# EAGLE design sqw_11c (EAGLE 5.11)
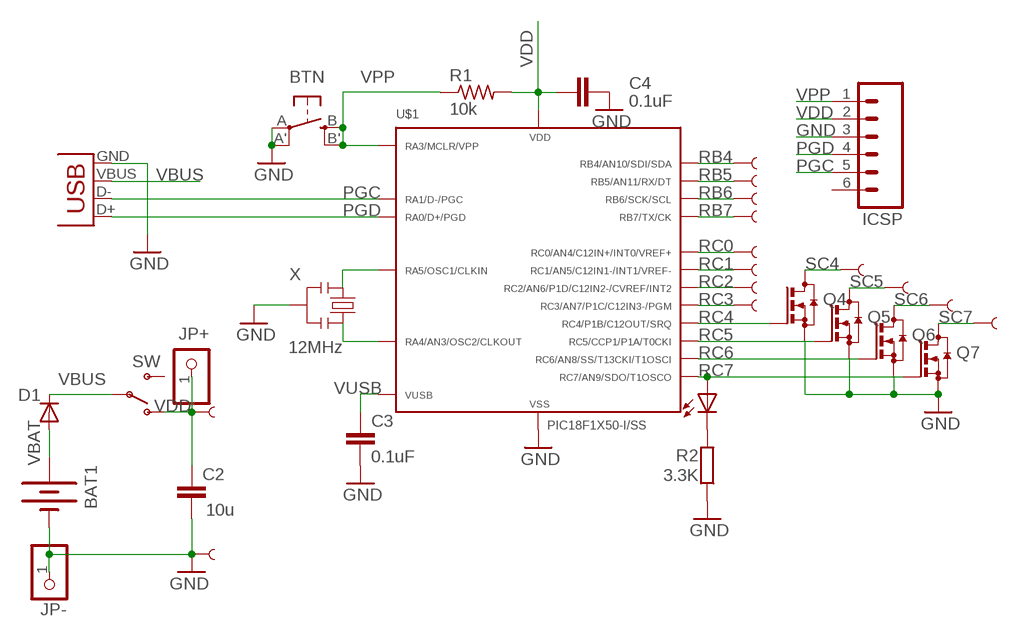
[diagram p0: schematic, sheet 1]

## Parts
BAT1  BATTERY20MM_4LEGS  [BATTCON_20MM_4LEGS]
BTN  EVQQ2  [EVQ-Q2]
C2  10u  C-EUC0805  [C0805]
C3  0.1uF  C-EUC0805  [C0805]
C4  0.1uF  C-EUC0805  [C0805]
D1  DIODESOT23  [SOT23-3]
ICSP  M06SIP  [1X06]
JP+  PINHD-1X1CB  [1X01-CLEANBIG]
JP-  PINHD-1X1CB  [1X01-CLEANBIG]
LED  0805  LEDCHIPLED_0805  [CHIPLED_0805]
PB4  SEWTAP61  [PETAL-SMALL-2SIDE1]
PB5  SEWTAP6  SEWTAP61  [PETAL-SMALL-2SIDE1]
PB6  SEWTAP6  SEWTAP61  [PETAL-SMALL-2SIDE1]
PB7  SEWTAP6  SEWTAP61  [PETAL-SMALL-2SIDE1]
PC0  SEWTAP6  SEWTAP61  [PETAL-SMALL-2SIDE1]
PC1  SEWTAP6  SEWTAP61  [PETAL-SMALL-2SIDE1]
PC2  SEWTAP6  SEWTAP61  [PETAL-SMALL-2SIDE1]
PC3  SEWTAP6  SEWTAP61  [PETAL-SMALL-2SIDE1]
PG  SEWTAP6  SEWTAP611  [PETAL-SMALL-2SIDE11]
PSC4  SEWTAP6  SEWTAP61  [PETAL-SMALL-2SIDE1]
PSC5  SEWTAP6  SEWTAP61  [PETAL-SMALL-2SIDE1]
PSC6  SEWTAP6  SEWTAP61  [PETAL-SMALL-2SIDE1]
PSC7  SEWTAP6  SEWTAP61  [PETAL-SMALL-2SIDE1]
PVCC  SEWTAP6  SEWTAP611  [PETAL-SMALL-2SIDE11]
Q4  BSS123  [SOT23]
Q5  BSS123  [SOT23]
Q6  BSS123  [SOT23]
Q7  BSS123  [SOT23]
R1  10k  R-US_R0805  [R0805@1]
R2  3.3K  R-EU_R0805  [R0805]
SW  SPDT  SWITCH-SPSTSMD2  [SWITCH-SPDT-SMD]
U$1  PIC18F1X50-I/SS  [SSOP20]
X  12MHz  RESONATORSMD  [RESONATOR-SMD]
X1  USBSMD  [USB-MINIB]

## Nets
GND: BAT1.2(-) BTN.A'(P1) BTN.A(P) C2.2 C3.2 C4.2 ICSP.3 JP-.1 PG.1 Q4.2(S) Q5.2(S) Q6.2(S) Q7.2(S) R2.1 U$1.20 X1.GND X.2
N$2: U$1.2 X.1
N$3: U$1.3 X.3
N$14: LED.C R2.2
PGC: ICSP.5 U$1.18 X1.D-
PGD: ICSP.4 U$1.19 X1.D+
RB4: PB4.1 U$1.13
RB5: PB5.1 U$1.12
RB6: PB6.1 U$1.11
RB7: PB7.1 U$1.10
RC0: PC0.1 U$1.16
RC1: PC1.1 U$1.15
RC2: PC2.1 U$1.14
RC3: PC3.1 U$1.7
RC4: Q4.1(G) U$1.6
RC5: Q5.1(G) U$1.5
RC6: Q6.1(G) U$1.8
RC7: LED.A Q7.1(G) U$1.9
SC4: PSC4.1 Q4.3(D)
SC5: PSC5.1 Q5.3(D)
SC6: PSC6.1 Q6.3(D)
SC7: PSC7.1 Q7.3(D)
VBAT: BAT1.1(+) D1.1(A)
VBUS: D1.3(C) SW.2(P) X1.VBUS
VDD: C2.1 C4.1 ICSP.2 JP+.1 PVCC.1 R1.2 SW.1(O) U$1.1
VPP: BTN.B'(S1) BTN.B(S) ICSP.1 R1.1 U$1.4
VUSB: C3.1 U$1.17
Unconnected: ICSP.6 SW.3(S)

## Library data of the parts
BAT1 = SparkFunNew:BATTERY: Battery Holders Various common sizes : AA, AAA, 20mm coin cell and 12mm coin cell.
BTN = adafruit:EVQQ2: SMT 6mm switch, EVQQ2 series http://www.ladyada.net/library/eagle
C2 = resistor:C-EU: CAPACITOR, European symbol
C3 C4 = rcl:C-EU: CAPACITOR, European symbol
D1 = SparkFun:DIODE: Diode These are standard reverse protection diodes and small signal diodes. SMA package can handle up to about 1A. SOD-323 can handle about 200mA. What the SOD-323 package when ordering, there are some mfgs out there that are 5-pin packages.
ICSP = SparkFunNew:M06: Header 6 Standard 6-pin 0.1" header. Use with straight break away headers (SKU : PRT-00116), right angle break away headers (PRT-00553), swiss pins (PRT-00743), machine pins (PRT-00117), and female headers (PRT-00115). Molex polarized connector foot print use with SKU : PRT-08094 with associated crimp pins and housings. NOTES ON THE VARIANTS LOCK and LOCK_LONGPADS... This footprint was designed to help hold the alignment of a through-hole component (i.e. 6-pin header) while soldering it into place. You may notice that each hole has been shifted either up or down by 0.005 of an inch from it's more standard position (which is a perfectly straight line). This slight alteration caused the pins (the squares in the middle) to touch the edges of the holes. Because they are alternating, it causes a "brace" to hold the component in place. 0.005 has proven to be the perfect amount of "off-center" position when using our standard breakaway headers. Although looks a little odd when you look at the bare footprint, once you have a header in there, the alteration is very hard to notice. Also, if you push a header all the way into place, it is covered up entirely on the bottom side. This idea of altering the position of holes to aid alignment will be further integrated into the Sparkfun Library for other footprints. It can help hold any component with 3 or more connection pins.
JP+ JP- = adafruit:PINHD-1X1: Pin header 1x1 for 0.1" spacing With round pins
LED = led:LED: LED OSRAM: - CHIPLED LG R971, LG N971, LY N971, LG Q971, LY Q971, LO R971, LY R971 LH N974, LH R974 LS Q976, LO Q976, LY Q976 LO Q996 - Hyper CHIPLED LW Q18S LB Q993, LB Q99A, LB R99A - SideLED LS A670, LO A670, LY A670, LG A670, LP A670 LB A673, LV A673, LT A673, LW A673 LH A674 LY A675 LS A676, LA A676, LO A676, LY A676, LW A676 LS A679, LY A679, LG A679 - Hyper Micro SIDELED® LS Y876, LA Y876, LO Y876, LY Y876 LT Y87S - SmartLED LW L88C, LW L88S LB L89C, LB L89S, LG L890 LS L89K, LO L89K, LY L89K LS L896, LA L896, LO L896, LY L896 - TOPLED LS T670, LO T670, LY T670, LG T670, LP T670 LSG T670, LSP T670, LSY T670, LOP T670, LYG T670 LG T671, LOG T671, LSG T671 LB T673, LV T673, LT T673, LW T673 LH T674 LS T676, LA T676, LO T676, LY T676, LB T676, LH T676, LSB T676, LW T676 LB T67C, LV T67C, LT T67C, LS T67K, LO T67K, LY T67K, LW E67C LS E67B, LA E67B, LO E67B, LY E67B, LB E67C, LV E67C, LT E67C LW T67C LS T679, LY T679, LG T679 LS T770, LO T770, LY T770, LG T770, LP T770 LB T773, LV T773, LT T773, LW T773 LH T774 LS E675, LA E675, LY E675, LS T675 LS T776, LA T776, LO T776, LY T776, LB T776 LHGB T686 LT T68C, LB T68C - Hyper Mini TOPLED® LB M676 - Mini TOPLED Santana® LG M470 LS M47K, LO M47K, LY M47K Source: http://www.osram.convergy.de LUXEON: - LUMILED® LXK2-PW12-R00, LXK2-PW12-S00, LXK2-PW14-U00, LXK2-PW14-V00 LXK2-PM12-R00, LXK2-PM12-S00, LXK2-PM14-U00 LXK2-PE12-Q00, LXK2-PE12-R00, LXK2-PE12-S00, LXK2-PE14-T00, LXK2-PE14-U00 LXK2-PB12-K00, LXK2-PB12-L00, LXK2-PB12-M00, LXK2-PB14-N00, LXK2-PB14-P00, LXK2-PB14-Q00 LXK2-PR12-L00, LXK2-PR12-M00, LXK2-PR14-Q00, LXK2-PR14-R00 LXK2-PD12-Q00, LXK2-PD12-R00, LXK2-PD12-S00 LXK2-PH12-R00, LXK2-PH12-S00 LXK2-PL12-P00, LXK2-PL12-Q00, LXK2-PL12-R00 Source: www.luxeon.com KINGBRIGHT: KA-3528ASYC Source: www.kingbright.com
PB4-PB7 PC0 PC1-PC3 PG PSC4-PSC7 PVCC = LilyPad-Wearables:SEWTAP
Q4-Q7 = transistor-small-signal:BSS123: N-CHANNEL MOS FET
R1 = rcl:R-US_: RESISTOR, American symbol
R2 = rcl:R-EU_: RESISTOR, European symbol
SW = SparkFun:SWITCH-SPST: SPST Switch Simple slide switch. Spark Fun Electronics SKU : COM-00102
U$1 = Forrequi:PIC18F1X50: PIC18F13K50/14K50 20-Pin USB Flash Microcontrollers with nanoWatt Technology The PIC18F14K50 brings advanced features and exceptional value to the embedded USB market. This low cost PIC® Microcontroller features a full speed USB 2.0 compliant interface that c an automatically change clock sources and power levels upon connection to a host, making it an exceptional device for battery-powered applications. The addition of mTouch(TM) touch sensing compatibility, a 10-bit ADC, motor control PWMs, and a host of serial interfaces make the PIC18F14K50 the perfect device to "Just add USB" to any application. Datasheet <http://ww1.microchip.com/downloads/en/DeviceDoc/41350C.pdf>
X = SparkFunNew:RESONATOR: Resonator Small SMD resonator. This is the itty bitty 10/20MHz resonators with built in caps. CSTCE10M0G55 and CSTCE20M0V53. Footprint has been reviewed closely but hasn't been tested yet.
X1 = SparkFun:USB: USB Connectors USB-B-PTH is fully proven SKU : PRT-00139 USB-miniB is fully proven SKU : PRT-00587 USB-A-PCB is untested. USB-A-H is throughly reviewed, but untested. Spark Fun Electronics SKU : PRT-00437 USB-B-SMT is throughly reviewed, but untested. Needs silkscreen touching up. USB-A-S has not been used/tested USB-MB-H has not been used/tested

## Net classes
0 default: width 0.254 mm, clearance 0.203 mm
1 power: width 0.254 mm, clearance 0.203 mm

## Board
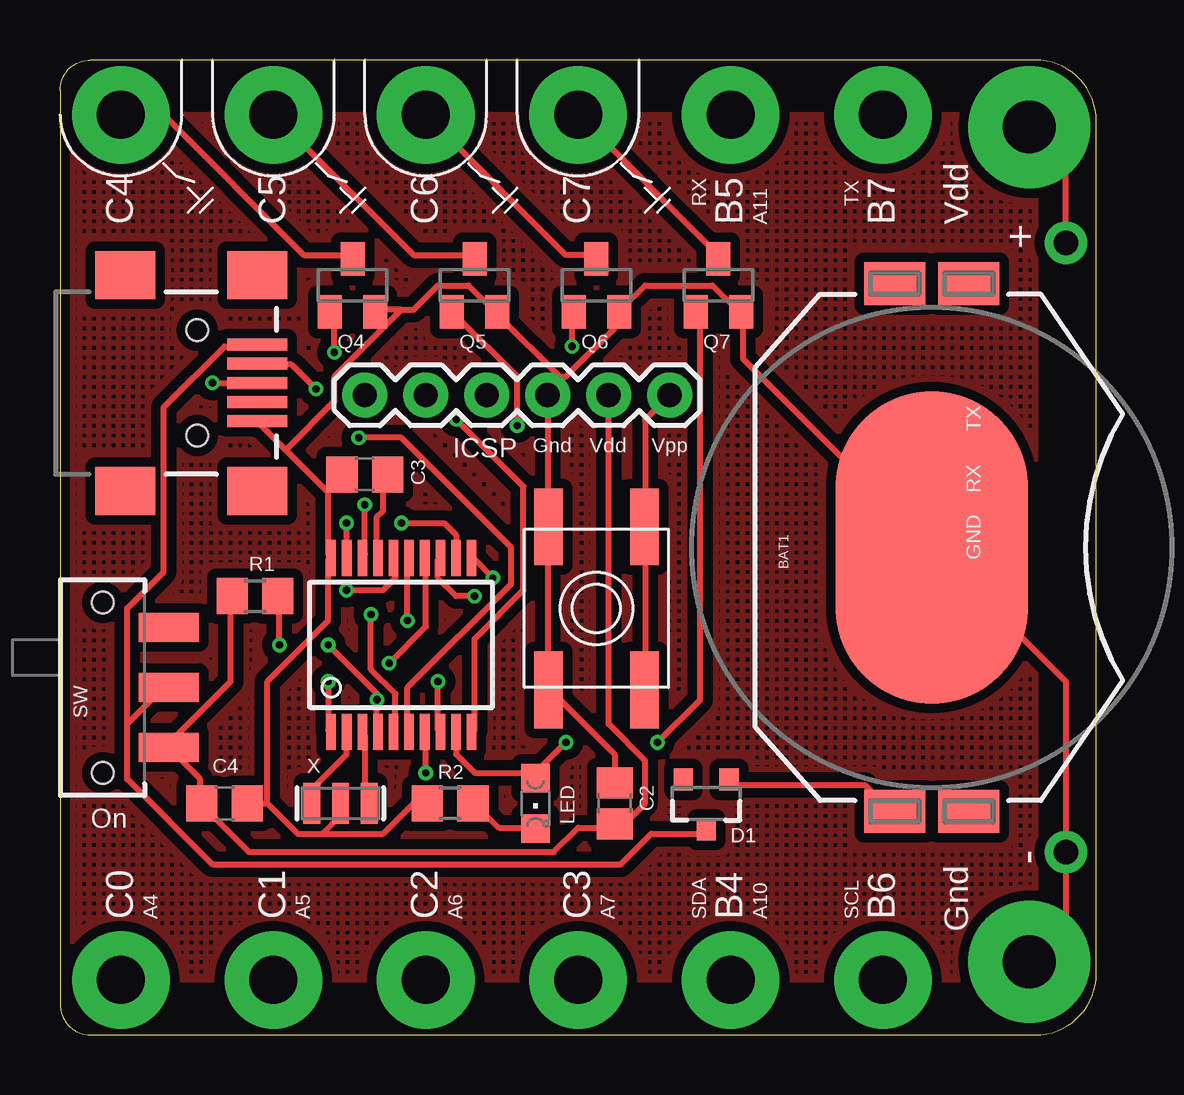
[diagram p1: board, top side]
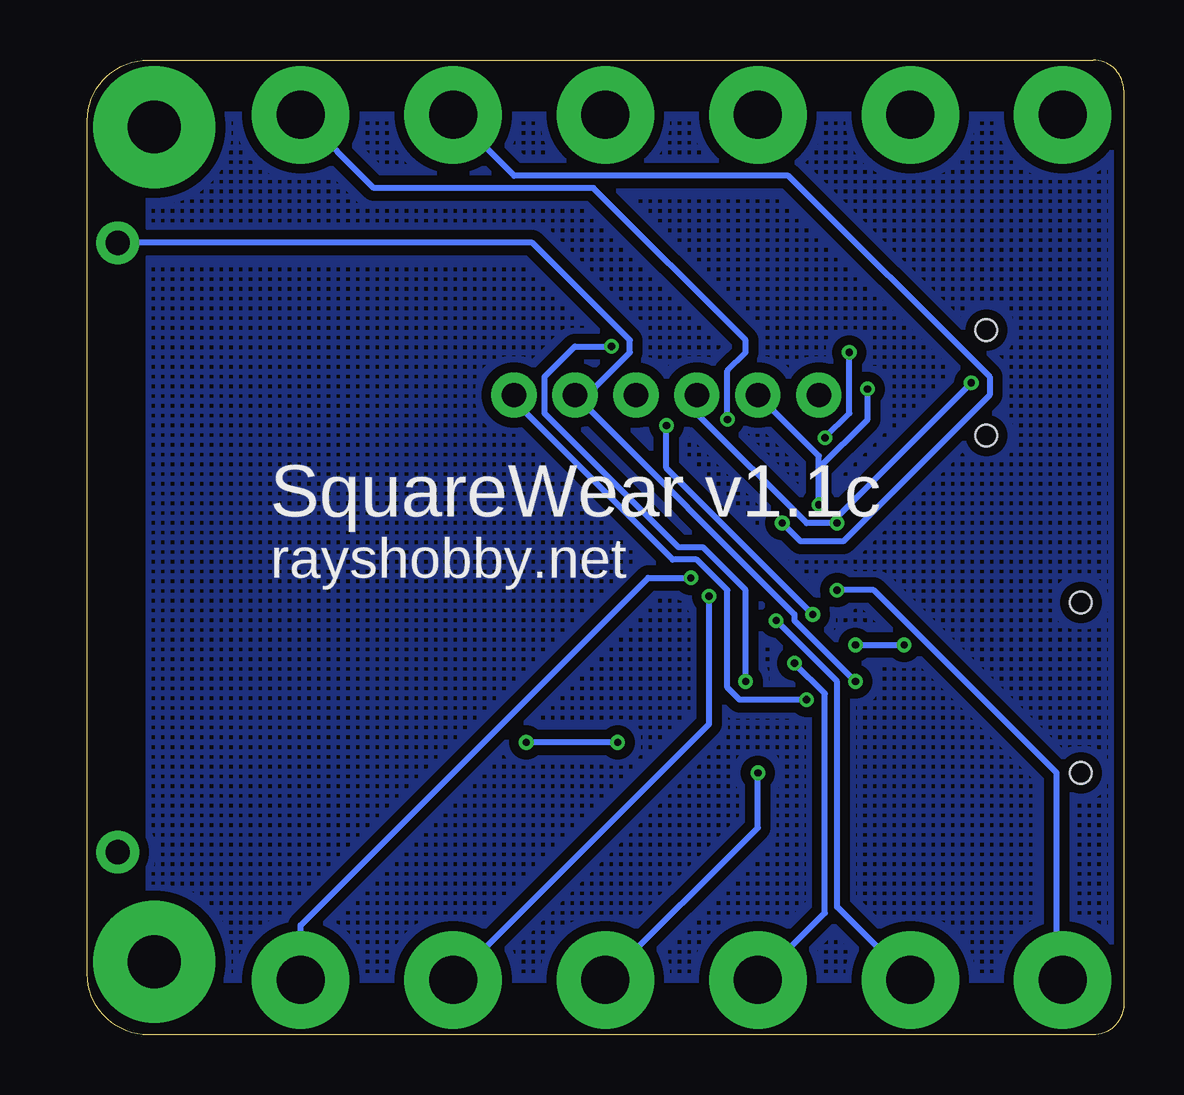
[diagram p2: board, bottom side, seen from below]

Size 43.18 x 40.64 mm. Coordinates in mm from the lower left corner, seen from the top.
Outline: 1.27,0 40.64,0 arc90 43.18,2.54 43.18,38.1 arc90 40.64,40.64 1.27,40.64 arc90 0,39.37 0,1.27 arc90 1.27,0
Copper layers (1*16): Top 0.035mm / dielectric 1.5mm / Bottom 0.035mm
Design rules "Fusion_eagle_rule_v1.1 *": minimum track width 6mil, minimum drill 12mil, track to track 6mil, track to pad 6mil, pad to pad 6mil, via to via 6mil, smd to smd 0mil, copper to edge 10mil, drill to drill 10mil, minimum pad ring 10mil, minimum via ring 6mil, stop-mask expansion 2mil, vias tented up to drill 100mil, thermal gap 20mil
vRestrict: area 36.8,4.3 to 37.8,7.1; area 36.8,33.8 to 37.8,36.6; area 37.6,25.1 to 38.4,26.2; area 37.6,22.6 to 38.4,23.6; area 37.6,19.8 to 38.4,21.3; area 7.9,19.3 to 8.9,20.1; area 7.9,13.2 to 8.9,14; area 16,24.1 to 26.2,24.9; area 1.8,4.8 to 35.3,6.6; area 1.8,33.8 to 34.8,35.6; area 10.7,29.5 to 13.7,33; area 15.7,29.5 to 18.8,33; 4 more areas

### Footprints (pad centres in the part's own frame; a part is rotated, then mirrored left to right if it is on the bottom)
BATTCON_20MM_4LEGS = smd 1.778 x 2.54: 1 -11,1.55; 3 11,1.55; P$1 -11,-1.55; P$2 11,-1.55 | smd 13 x 8: 2 0,0
EVQ-Q2 = smd 3.2 x 1.2: A -3.4,-2; A' 3.4,-2; B -3.4,2; B' 3.4,2
C0805 = smd 1.3 x 1.5: 1 -0.85,0; 2 0.85,0
C0805' = smd 1.3 x 1.5: 1 -0.95,0; 2 0.95,0
SOT23-3 = smd 0.8 x 0.9: 1 -0.95,-1; 2 0.95,-1; 3 0,1.1
1X06 = drill 1.016 pad 1.88 round: 1 0,0; 2 2.54,0; 3 5.08,0; 4 7.62,0; 5 10.16,0; 6 12.7,0
1X01-CLEANBIG = drill 1.016 pad 1.778 round: 1 0,0
CHIPLED_0805 = smd 1.2 x 1.2: A 0,-1.05; C 0,1.05
PETAL-SMALL-2SIDE1 = drill 2 pad 4.064 round: 1 0,0
PETAL-SMALL-2SIDE11 = drill 2.2 pad 5.08 round: 1 0,0
SOT23 = smd 1 x 1.4: 1 -0.95,-1.1; 2 0.95,-1.1; 3 0,1.1
R0805@1 = smd 1.3 x 1.5: 1 -0.95,0; 2 0.95,0
R0805 = smd 1.3 x 1.5: 1 -0.95,0; 2 0.95,0
SWITCH-SPDT-SMD = smd 1.2 x 2.5: 1 -2.5,-2.75; 2 0,-2.75; 3 2.5,-2.75 | hole 0.9: -3.55,0; 3.55,0
SSOP20 = smd 0.4 x 1.5: 1 -2.925,-3.625; 2 -2.275,-3.625; 3 -1.625,-3.625; 4 -0.975,-3.625; 5 -0.325,-3.625; 6 0.325,-3.625; 7 0.975,-3.625; 8 1.625,-3.625; 9 2.275,-3.625; 10 2.925,-3.625; 11 2.925,3.625; 12 2.275,3.625; 13 1.625,3.625; 14 0.975,3.625; 15 0.325,3.625; 16 -0.325,3.625; 17 -0.975,3.625; 18 -1.625,3.625; 19 -2.275,3.625; 20 -2.925,3.625
RESONATOR-SMD = smd 0.7 x 1.7: 1 -1.2,0; 2 0,0; 3 1.2,0
USB-MINIB = smd 2.5 x 0.5: D+ 2.5,0; D- 2.5,0.8; GND 2.5,-1.6; ID 2.5,-0.8; VBUS 2.5,1.6 | smd 2.5 x 2: GND@1 -3,-4.5; GND@2 -3,4.5; GND@3 2.5,4.5; GND@4 2.5,-4.5 | hole 0.9: 0,2.2; 0,-2.2

### Placement (x,y rotation side)
BAT1  36.32,20.32 90 top
BTN  22.35,17.78 270 top
C2  23.11,9.65 90 top
C3  0.1uF  [C0805']  12.7,23.37 180 top
C4  0.1uF  [C0805']  6.86,9.65 0 top
D1  26.92,9.65 180 top
ICSP  25.4,26.67 180 top
JP+  41.91,33.02 90 top
JP-  41.91,7.62 90 top
LED  19.81,9.65 180 top
PB4  27.94,2.29 180 top
PB5  27.94,38.35 180 top
PB6  34.29,2.29 180 top
PB7  34.29,38.35 180 top
PC0  2.54,2.29 0 top
PC1  8.89,2.29 0 top
PC2  15.24,2.29 0 top
PC3  21.59,2.29 0 top
PG  40.39,3.05 270 top
PSC4  2.54,38.35 90 top
PSC5  8.89,38.35 180 top
PSC6  15.24,38.35 180 top
PSC7  21.59,38.35 0 top
PVCC  40.39,37.85 180 top
Q4  12.19,31.24 0 top
Q5  17.27,31.24 0 top
Q6  22.35,31.24 0 top
Q7  27.43,31.24 0 top
R1  8.13,18.29 180 top
R2  16.26,9.65 0 top
SW  1.78,14.48 90 top
U$1  14.22,16.26 0 top
X  11.68,9.65 0 top
X1  5.71,27.18 0 top

### Tracks (layer width: path | path; a pad name or v marks a point on that pad's centre or on a via)
GND
  Top 0.254: 8.64,9.65 9.91,8.38 10.92,8.38 | 10.92,8.38 11.68,9.14 X.2 | C4.2 8.64,9.65 | 10.92,8.38 13.46,8.38 14.73,9.65 R2.1 | 11.18,22.61 11.18,22.86 11.68,23.37 C3.2 | 11.18,22.61 11.18,20.07 U$1.20 11.18,19.81 11.18,17.27 8.64,14.73 8.64,9.65 | 11.18,22.61 9.4,24.38 | 9.4,24.38 8.38,25.4 X1.GND | C2.2 23.11,11.68 20.57,14.22 BTN.A' 20.32,14.48 20.32,21.08 BTN.A 20.32,21.34 ICSP.3 21.08,27.43 | 14.22,30.23 14.73,30.23 15.75,31.24 17.02,31.24 18.03,30.23 Q5.2 18.29,29.97 20.83,27.43 21.08,27.43 | 14.22,30.23 13.21,30.23 Q4.2 | 21.08,27.43 23.11,29.46 23.11,29.97 Q6.2 23.37,30.23 24.38,31.24 27.18,31.24 28.19,30.23 Q7.2 28.45,29.97 28.45,28.19 BAT1.2 41.91,14.73 JP-.1 41.91,4.57 PG.1 | 9.4,24.38 11.43,26.42 11.43,27.43 14.22,30.23
N$1
  pour Top (isolate 0.406, hatched): 0,38.35 40.64,38.35 40.64,2.29 0,2.29
N$2
  Top 0.254: U$1.2 11.94,12.45 11.94,11.68 10.67,10.41 10.67,9.65 X.1
N$3
  Top 0.254: U$1.3 12.7,12.45 12.7,9.65 X.3
N$4
  pour Bottom (isolate 0.406, hatched): 0,38.35 40.64,38.35 40.64,2.29 0,2.29
N$14
  Top 0.254: LED.C 19.81,8.64 18.29,8.64 17.27,9.65 R2.2
PGC  (via drill 0.3)
  Top 0.254: v12.7,22.1 12.7,20.07 U$1.18 | v10.67,26.92 9.65,27.94 8.38,27.94 X1.D-
  Bottom 0.254: 12.7,23.62 12.7,24.13 ICSP.5 | v12.7,22.1 12.7,23.62 | v10.67,26.92 10.67,25.65 12.7,23.62
PGD  (via drill 0.3)
  Top 0.254: v11.94,21.34 11.94,20.07 U$1.19 | v6.35,27.18 X1.D+
  Bottom 0.254: 12.19,21.34 13.21,21.34 17.78,25.91 ICSP.4 | 12.19,21.34 v6.35,27.18 | v11.94,21.34 12.19,21.34
RB4  (via drill 0.3)
  Top 0.254: v17.27,18.29 16.51,18.29 15.75,19.05 15.75,19.81 U$1.13
  Bottom 0.254: v17.27,18.29 17.27,12.95 PB4.1
RB5  (via drill 0.3)
  Top 0.254: v14.22,21.34 16,21.34 16.51,20.83 16.51,20.07 U$1.12
  Bottom 0.254: v14.22,21.34 13.46,20.57 11.68,20.57 5.59,26.67 5.59,27.43 13.97,35.81 25.4,35.81 PB5.1
RB6  (via drill 0.3)
  Top 0.254: v18.03,19.05 17.27,19.81 U$1.11
  Bottom 0.254: v18.03,19.05 19.81,19.05 34.29,4.57 PB6.1
RB7  (via drill 0.3)
  Top 0.254: v16.51,25.65 19.3,22.86 19.3,18.54 17.27,16.51 17.27,12.7 U$1.10
  Bottom 0.254: v16.51,25.65 16.51,27.69 15.75,28.45 15.75,28.96 22.1,35.31 31.24,35.31 PB7.1
RC0  (via drill 0.3)
  Top 0.254: v11.94,18.54 13.46,18.54 13.97,19.05 13.97,19.81 U$1.16
  Bottom 0.254: v11.94,18.54 10.41,18.54 2.79,10.92 2.79,2.54 PC0.1
RC1  (via drill 0.3)
  Top 0.254: v14.48,17.27 14.48,19.81 U$1.15
  Bottom 0.254: v14.48,17.27 11.94,14.73 11.94,5.33 PC1.1
RC2  (via drill 0.3)
  Top 0.254: v13.72,15.49 15.24,17.02 15.24,19.81 U$1.14
  Bottom 0.254: v13.72,15.49 12.45,14.22 12.45,5.08 PC2.1
RC3  (via drill 0.3)
  Top 0.254: v15.24,10.92 15.24,12.45 U$1.7
  Bottom 0.254: v15.24,10.92 15.24,8.64 PC3.1
RC4  (via drill 0.3)
  Top 0.254: v11.43,28.45 11.43,29.97 Q4.1 | v12.45,24.89 14.22,24.89 18.8,20.32 18.8,18.8 14.48,14.48 14.48,12.7 U$1.6
  Bottom 0.254: v11.43,28.45 11.43,25.91 v12.45,24.89
RC5  (via drill 0.3)
  Top 0.254: v19.05,25.4 19.05,27.43 16.51,29.97 Q5.1 | v12.95,17.53 12.95,15.24 13.97,14.22 13.97,12.7 U$1.5
  Bottom 0.254: v19.05,25.4 19.05,23.62 v12.95,17.53
RC6  (via drill 0.3)
  Top 0.254: v21.34,28.7 21.34,29.97 Q6.1 | v15.75,14.73 15.75,12.7 U$1.8
  Bottom 0.254: v21.34,28.7 22.86,28.7 24.13,27.43 24.13,25.91 18.54,20.32 17.53,20.32 15.75,18.54 v15.75,14.73
RC7  (via drill 0.3)
  Top 0.254: 19.81,10.92 17.27,10.92 16.51,11.68 16.51,12.45 U$1.9 | v24.89,12.19 26.67,13.97 26.67,29.97 Q7.1 | 19.81,10.92 v21.08,12.19 | 19.81,10.92 LED.A
  Bottom 0.254: v21.08,12.19 v24.89,12.19
SC4
  Top 0.254: PSC4.1 4.32,38.35 10.16,32.51 12.19,32.51 Q4.3
SC5
  Top 0.254: PSC5.1 14.73,32.51 17.27,32.51 Q5.3
SC6
  Top 0.254: PSC6.1 21.08,32.51 22.35,32.51 Q6.3
SC7
  Top 0.254: PSC7.1 27.43,32.51 Q7.3
VBAT
  Top 0.254: D1.1 27.94,10.41 33.53,10.41 34.54,9.4 BAT1.1
VBUS
  Top 0.254: 2.79,12.95 2.79,10.67 6.35,7.11 23.37,7.11 24.64,8.38 26.92,8.38 D1.3 | 2.79,12.95 4.32,14.48 SW.2 | 2.79,12.95 2.79,17.78 4.32,19.3 4.32,26.16 6.86,28.7 8.13,28.7 X1.VBUS
VDD  (via drill 0.3)
  Top 0.254: 5.84,9.65 5.84,10.67 4.57,11.94 SW.1 4.57,12.19 7.11,14.73 7.11,18.29 R1.2 | 5.84,9.65 7.87,7.62 20.57,7.62 21.59,8.64 23.11,8.64 C2.1 23.11,8.89 23.62,8.89 24.38,9.65 24.38,11.43 22.86,12.95 ICSP.2 | C4.1 5.84,9.65 | JP+.1 41.91,36.32 PVCC.1 | v11.18,14.73 11.18,12.7 U$1.1
  Bottom 0.254: v11.18,14.73 13.72,17.27 13.72,17.53 22.61,26.42 | JP+.1 24.64,33.02 20.57,28.96 20.57,28.45 22.61,26.42 | ICSP.2 22.61,26.42
VPP  (via drill 0.3)
  Top 0.254: BTN.B' 24.38,14.48 24.38,21.08 BTN.B 24.38,21.34 24.38,25.65 ICSP.1 | U$1.4 13.21,12.7 v13.21,13.97 13.21,14.22 v11.18,16.26 | v9.14,16.26 9.14,18.29 R1.1
  Bottom 0.254: v13.21,13.97 16,13.97 16.51,14.48 16.51,18.54 17.78,19.81 18.8,19.81 25.4,26.42 ICSP.1 | v11.18,16.26 v9.14,16.26
VUSB
  Top 0.254: U$1.17 13.21,20.07 13.21,21.59 13.46,21.84 13.46,23.37 C3.1

### Text on the board
tNames: RX | TX | C4 | C5 | C6 | C7 | B5 | A11 | B7 | Vdd | + | Gnd | Vdd | Vpp | TX | RX | GND | On | - | C0 | A4 | C1 | A5 | C2 | A6 | C3 | A7 | SDA | B4 | A10 | SCL | B6 | Gnd
bNames: SquareWear v1.1c | rayshobby.net